# EAGLE design ESP32-S3 Parallel TFT with Touch 1.9“ ST7789V2 v1.1 (EAGLE 6.1)
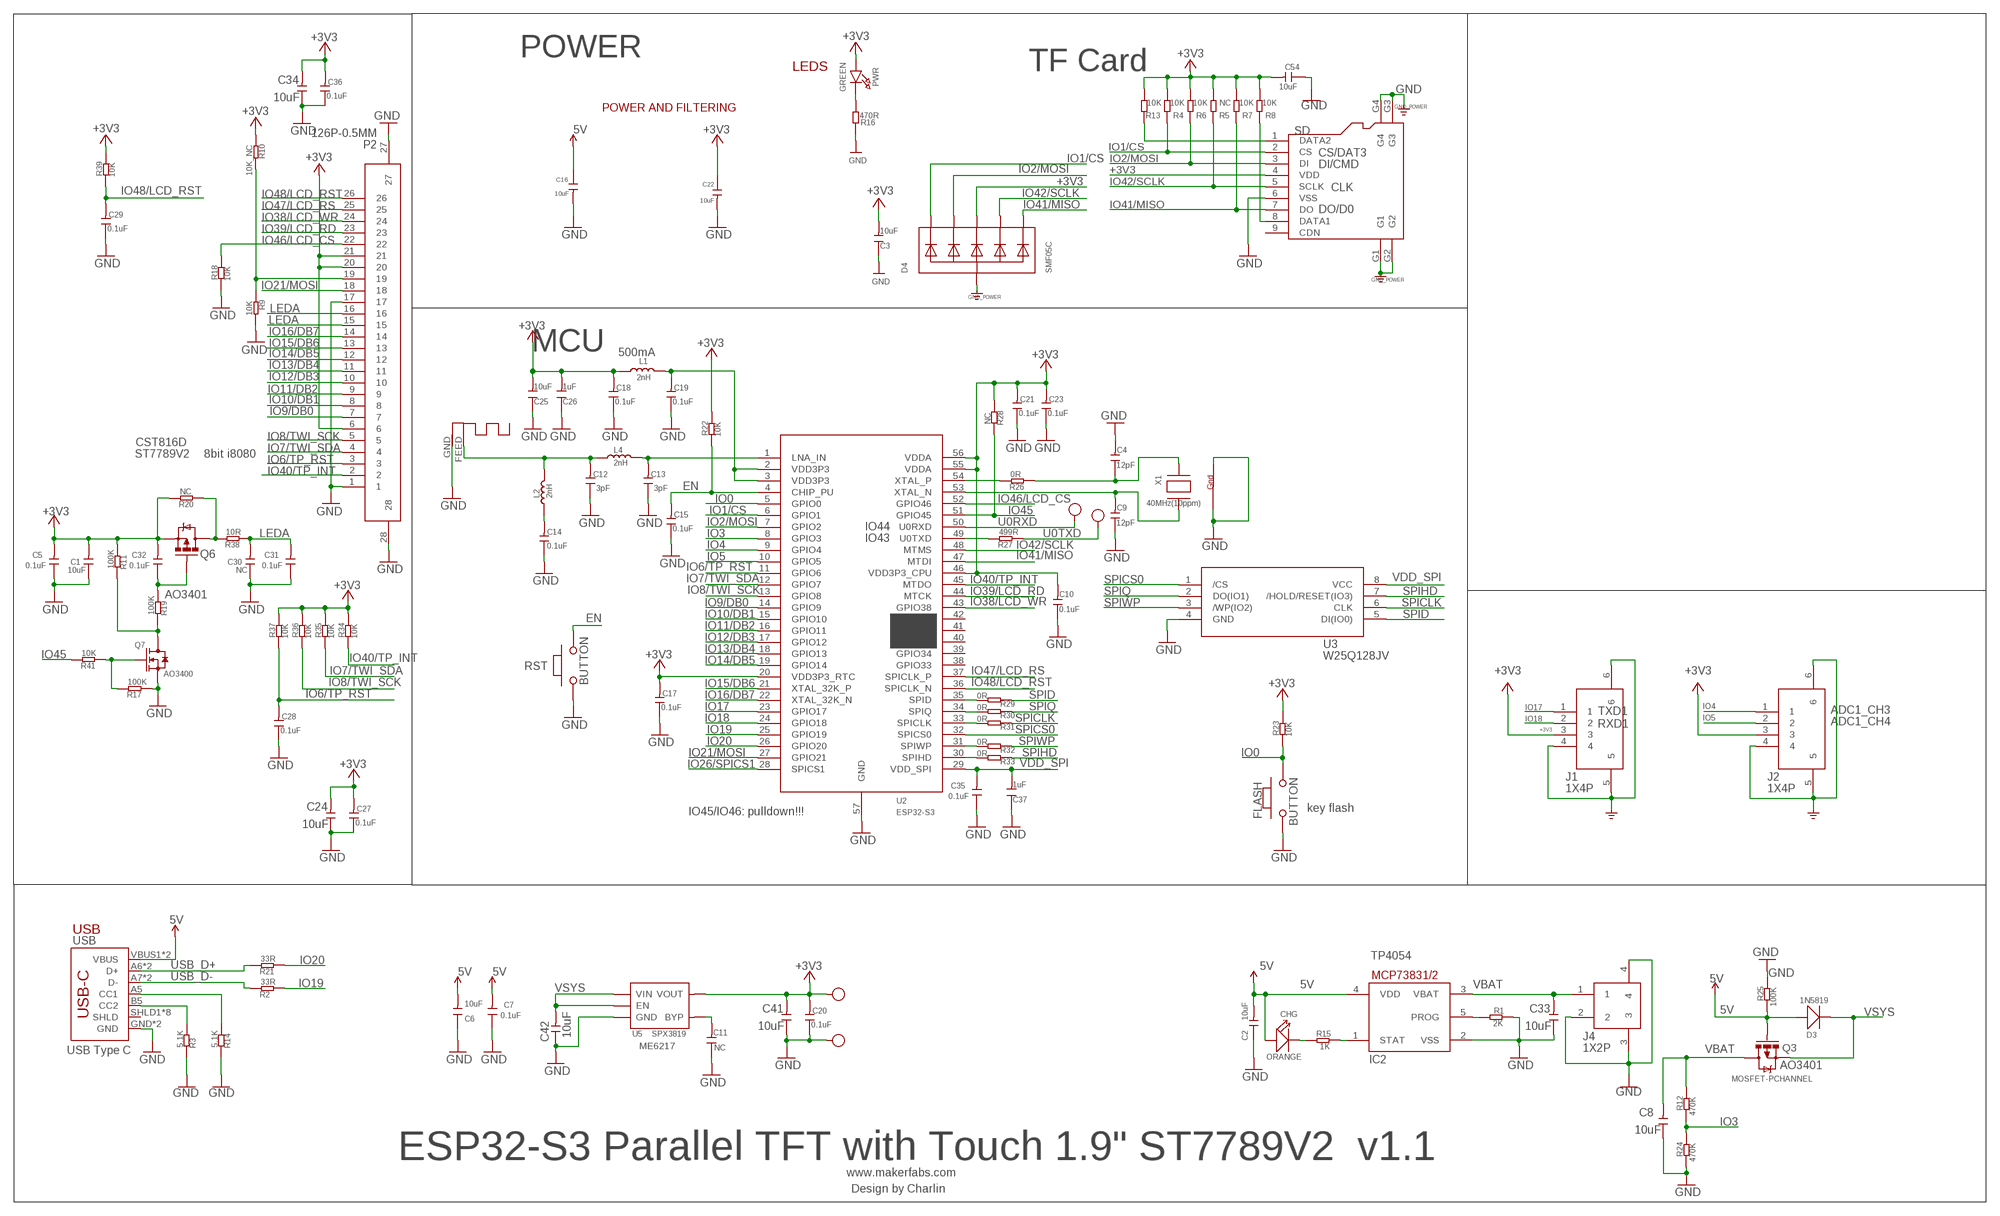
[diagram p0: schematic, sheet 1]

## Parts
ANT1  ANTENNA  [RN-ANT]
C1  10uF  C-0603  [0603]
C2  10uF  C-0603  [0603]
C3  10uF  DISCRETE_C-0603  [DISCRETE_C0603]
C4  12pF  DISCRETE_C-0402  [DISCRETE_C0402]
C5  0.1uF  DISCRETE_C-0402  [DISCRETE_C0402]
C6  10uF  DISCRETE_C-0603  [DISCRETE_C0603]
C7  0.1uF  DISCRETE_C-0402  [DISCRETE_C0402]
C8  10uF  C-0603  [0603]
C9  12pF  DISCRETE_C-0402  [DISCRETE_C0402]
C10  0.1uF  DISCRETE_C-0402  [DISCRETE_C0402]
C11  NC  DISCRETE_C-0402  [DISCRETE_C0402]
C12  3pF  DISCRETE_C-0402  [DISCRETE_C0402]
C13  3pF  DISCRETE_C-0402  [DISCRETE_C0402]
C14  0.1uF  DISCRETE_C-0402  [DISCRETE_C0402]
C15  0.1uF  DISCRETE_C-0402  [DISCRETE_C0402]
C16  10uF  C-0603  [0603]
C17  0.1uF  DISCRETE_C-0402  [DISCRETE_C0402]
C18  0.1uF  DISCRETE_C-0402  [DISCRETE_C0402]
C19  0.1uF  DISCRETE_C-0402  [DISCRETE_C0402]
C20  0.1uF  DISCRETE_C-0402  [DISCRETE_C0402]
C21  0.1uF  DISCRETE_C-0402  [DISCRETE_C0402]
C22  10uF  C-0603  [0603]
C23  0.1uF  DISCRETE_C-0402  [DISCRETE_C0402]
C24  10uF  C-0603  [0603]
C25  10uF  DISCRETE_C-0603  [DISCRETE_C0603]
C26  1uF  DISCRETE_C-0603  [DISCRETE_C0603]
C27  0.1uF  DISCRETE_C-0402  [DISCRETE_C0402]
C28  0.1uF  DISCRETE_C-0402  [DISCRETE_C0402]
C29  0.1uF  DISCRETE_C-0402  [DISCRETE_C0402]
C30  NC  C-0603  [0603]
C31  0.1uF  DISCRETE_C-0402  [DISCRETE_C0402]
C32  0.1uF  DISCRETE_C-0402  [DISCRETE_C0402]
C33  10uF  C-0603  [0603]
C34  10uF  C-0603  [0603]
C35  0.1uF  DISCRETE_C-0402  [DISCRETE_C0402]
C36  0.1uF  DISCRETE_C-0402  [DISCRETE_C0402]
C37  1uF  DISCRETE_C-0603  [DISCRETE_C0603]
C41  10uF  C-0603  [0603]
C42  10uF  C-0603  [0603]
C54  10uF  DISCRETE_C-0603  [DISCRETE_C0603]
CHG  ORANGE  007-LED0603  [D0603]
D3  1N5819  D'0805'  [SOD323]
D4  SMF05C  TVSARRAY_5LANE  [SOT363]
FLASH  BUTTON  PB157  [157SW]
G  TEST-POINT'4545'  [TP-D45MIL]
IC2  MCP73831/OT  [SOT23-5L]
J1  1X4P  [1X4P-SMT1.25MM]
J2  1X4P  [1X4P-SMT1.25MM]
J4  1X2P  [1X2P-SMT1.25MM]
L1  2nH  DISCRETE_L0603  [DISCRETE_L0603]
L2  2nH  DISCRETE_L0402  [DISCRETE_L0402]
L4  2nH  DISCRETE_L0402  [DISCRETE_L0402]
P2  126P-0.5MM  [1*26P-SMT0.5MM]
PWR  GREEN  LED0805_NOOUTLINE  [CHIPLED_0805_NOOUTLINE]
Q3  MOSFET-PCHANNEL  [SOT23-3]
Q6  MOSFET-PCHANNEL  [SOT23-3]
Q7  AO3400  DISCRETE_MOSFET-NSOT23  [DISCRETE_SOT23]
R1  2K  DISCRETE_R-0402  [DISCRETE_R0402]
R2  33R  DISCRETE_R-0402  [DISCRETE_R0402]
R3  5.1K  DISCRETE_R-0402  [DISCRETE_R0402]
R4  10K  DISCRETE_R-0402  [DISCRETE_R0402]
R5  NC  DISCRETE_R-0402  [DISCRETE_R0402]
R6  10K  DISCRETE_R-0402  [DISCRETE_R0402]
R7  10K  DISCRETE_R-0402  [DISCRETE_R0402]
R8  10K  DISCRETE_R-0402  [DISCRETE_R0402]
R9  10K  DISCRETE_R-0402  [DISCRETE_R0402]
R10  10K_NC  DISCRETE_R-0402  [DISCRETE_R0402]
R11  100K  DISCRETE_R-0402  [DISCRETE_R0402]
R12  470K  DISCRETE_R-0402  [DISCRETE_R0402]
R13  10K  DISCRETE_R-0402  [DISCRETE_R0402]
R14  5.1K  DISCRETE_R-0402  [DISCRETE_R0402]
R15  1K  DISCRETE_R-0402  [DISCRETE_R0402]
R16  470R  DISCRETE_R-0402  [DISCRETE_R0402]
R17  100K  DISCRETE_R-0402  [DISCRETE_R0402]
R18  10K  DISCRETE_R-0402  [DISCRETE_R0402]
R19  100K  DISCRETE_R-0402  [DISCRETE_R0402]
R20  NC  DISCRETE_R-0402  [DISCRETE_R0402]
R21  33R  DISCRETE_R-0402  [DISCRETE_R0402]
R22  10K  DISCRETE_R-0402  [DISCRETE_R0402]
R23  10K  DISCRETE_R-0402  [DISCRETE_R0402]
R24  470K  DISCRETE_R-0402  [DISCRETE_R0402]
R25  100K  DISCRETE_R-0402  [DISCRETE_R0402]
R26  0R  DISCRETE_R-0402  [DISCRETE_R0402]
R27  499R  DISCRETE_R-0402  [DISCRETE_R0402]
R28  NC  DISCRETE_R-0402  [DISCRETE_R0402]
R29  0R  DISCRETE_R-0402  [DISCRETE_R0402]
R30  0R  DISCRETE_R-0402  [DISCRETE_R0402]
R31  0R  DISCRETE_R-0402  [DISCRETE_R0402]
R32  0R  DISCRETE_R-0402  [DISCRETE_R0402]
R33  0R  DISCRETE_R-0402  [DISCRETE_R0402]
R34  10K  DISCRETE_R-0402  [DISCRETE_R0402]
R35  10K  DISCRETE_R-0402  [DISCRETE_R0402]
R36  10K  DISCRETE_R-0402  [DISCRETE_R0402]
R37  10K  DISCRETE_R-0402  [DISCRETE_R0402]
R38  10R  DISCRETE_R-0402  [DISCRETE_R0402]
R39  10K  DISCRETE_R-0402  [DISCRETE_R0402]
R41  10K  DISCRETE_R-0402  [DISCRETE_R0402]
RST  BUTTON  PB157  [157SW]
RX  TEST-POINT'4545'  [TP-D45MIL]
SD  HOLDER-MICROSD-9P  [9P-SMD-W/-RING]
TX  TEST-POINT'4545'  [TP-D45MIL]
U2  ESP32-S3  [QFN56-7*7MM]
U3  W25Q128JV  [SOIC-8-208MIL]
U5  SPX3819  [SOT23-5]
USB  USB_C5  [USB-C-16P-5]
V  TEST-POINT'4545'  [TP-D45MIL]
X1  40MHz(10ppm)  XTAL-4-3225  [NX3225]

## Nets
5V: C2.2 C6.2 C7.2 C16.1 CHG.+ D3.+ IC2.4(VDD) Q3.1(G) R25.1 USB.VBUS1(VBUS) USB.VBUS2(VBUS)
+3V3: C1.2 C3.2 C5.2 C10.2 C17.2 C18.2 C20.2 C21.2 C22.1 C23.2 C24.2 C25.2 C26.2 C27.2 C32.2 C34.2 C36.2 C41.2 C54.2 D4.4(C3) J1.3 J2.3 L1.1 P2.6 P2.20 P2.21 PWR.A Q6.2(S) R4.2 R5.2 R6.2 R7.2 R8.2 R10.2 R11.1 R13.2 R20.2 R22.2 R23.2 R28.1 R34.2 R35.2 R36.2 R37.2 R39.2 SD.4(VDD) U2.20(VDD3P3_RTC) U2.46(VDD3P3_CPU) U2.55(VDDA) U2.56(VDDA) U5.5(VOUT) V.T
EN: C15.2 R22.1 RST.2 U2.4(CHIP_PU)
GND: ANT1.GND C1.1 C2.1 C3.1 C4.2 C5.1 C6.1 C7.1 C8.1 C9.1 C10.1 C11.1 C12.1 C13.1 C14.1 C15.1 C16.2 C17.1 C18.1 C19.1 C20.1 C21.1 C22.2 C23.1 C24.1 C25.1 C26.1 C27.1 C28.1 C29.1 C30.1 C31.1 C33.1 C34.1 C35.1 C36.1 C37.1 C41.1 C42.1 C54.1 D4.2(A) FLASH.1 G.T IC2.2(VSS) J1.4 J1.5 J1.6 J2.4 J2.5 J2.6 J4.2 J4.3 J4.4 P2.1 P2.17 P2.27 P2.28 Q7.2(S) R1.2 R3.2 R9.1 R14.2 R16.1 R17.1 R18.1 R24.1 R25.2 RST.1 SD.6(VSS) SD.G1 SD.G2 SD.G3 SD.G4 U2.57(GND) U3.4(GND) U5.2(GND) USB.GND USB.GND2(GND) X1.2(G2) X1.4(G1) ; supply symbol labelled GND_POWER
IO0: FLASH.2 R23.1 U2.5(GPIO0)
IO1/CS: D4.1(C1) R4.1 SD.2(CS) U2.6(GPIO1)
IO2/MOSI: D4.3(C2) R6.1 SD.3(DI) U2.7(GPIO2)
IO3: R12.1 R24.2 U2.8(GPIO3)
IO4: J2.1 U2.9(GPIO4)
IO5: J2.2 U2.10(GPIO5)
IO6/TP_RST: C28.2 P2.3 R37.1 U2.11(GPIO6)
IO7/TWI_SDA: P2.4 R35.1 U2.12(GPIO7)
IO8/TWI_SCK: P2.5 R36.1 U2.13(GPIO8)
IO9/DB0: P2.7 U2.14(GPIO9)
IO10/DB1: P2.8 U2.15(GPIO10)
IO11/DB2: P2.9 U2.16(GPIO11)
IO12/DB3: P2.10 U2.17(GPIO12)
IO13/DB4: P2.11 U2.18(GPIO13)
IO14/DB5: P2.12 U2.19(GPIO14)
IO15/DB6: P2.13 U2.21(XTAL_32K_P)
IO16/DB7: P2.14 U2.22(XTAL_32K_N)
IO17: J1.1 U2.23(GPIO17)
IO18: J1.2 U2.24(GPIO18)
IO19: R2.1 U2.25(GPIO19)
IO20: R21.1 U2.26(GPIO20)
IO21/MOSI: P2.18 U2.27(GPIO21)
IO26/SPICS1: U2.28(SPICS1)
IO38/LCD_WR: P2.24 U2.43(GPIO38)
IO39/LCD_RD: P2.23 U2.44(MTCK)
IO40/TP_INT: P2.2 R34.1 U2.45(MTDO)
IO41/MISO: D4.6(C5) R7.1 SD.7(DO) U2.47(MTDI)
IO42/SCLK: D4.5(C4) R5.1 SD.5(SCLK) U2.48(MTMS)
IO45: R28.2 R41.2 U2.51(GPIO45)
IO46/LCD_CS: P2.22 R18.2 U2.52(GPIO46)
IO47/LCD_RS: P2.25 U2.37(SPICLK_P)
IO48/LCD_RST: C29.2 P2.26 R39.1 U2.36(SPICLK_N)
LEDA: C30.2 C31.2 P2.15 P2.16 R38.1
N$2: IC2.5(PROG) R1.1
N$3: C32.1 Q6.1(G) R19.1
N$6: R14.1 USB.A5(CC1)
N$7: PWR.C R16.2
N$8: P2.19 R9.2 R10.1
N$10: Q6.3(D) R20.1 R38.2
N$14: R3.1 USB.B5(CC2)
N$15: Q7.3(D) R11.2 R19.2
N$19: Q7.1(G) R17.2 R41.1
N$25: CHG.- R15.1
N$26: IC2.1(STAT) R15.2
N$30: ANT1.FEED C12.2 L2.2 L4.1
N$31: C13.2 L4.2 U2.1(LNA_IN)
N$32: R29.2 U2.35(SPID)
N$33: C19.2 L1.2 U2.2(VDD3P3) U2.3(VDD3P3)
N$34: C14.2 L2.1
N$35: R30.2 U2.34(SPIQ)
N$37: R26.2 U2.54(XTAL_P)
N$38: R31.2 U2.33(SPICLK)
N$40: R32.2 U2.31(SPIWP)
N$41: R33.2 U2.30(SPIHD)
N$47: R13.1 SD.1(DATA2)
N$48: R8.1 SD.8(DATA1)
N$63: R27.2 U2.49(U0TXD)
N$65: C9.2 U2.53(XTAL_N) X1.3(X2)
N$66: C4.1 R26.1 X1.1(X1)
N$76: C11.2 U5.4(BYP)
SPICLK: R31.1 U3.6(CLK)
SPICS0: U2.32(SPICS0) U3.1(/CS)
SPID: R29.1 U3.5(DI(IO0))
SPIHD: R33.1 U3.7(/HOLD/RESET(IO3))
SPIQ: R30.1 U3.2(DO(IO1))
SPIWP: R32.1 U3.3(/WP(IO2))
U0RXD: RX.T U2.50(U0RXD)
U0TXD: R27.1 TX.T
USB_D+: R21.2 USB.A6(D+) USB.B6(D+)
USB_D-: R2.2 USB.A7(D-) USB.B7(D-)
VBAT: C8.2 C33.2 IC2.3(VBAT) J4.1 Q3.3(D) R12.2
VDD_SPI: C35.2 C37.2 U2.29(VDD_SPI) U3.8(VCC)
VSYS: C42.2 D3.- Q3.2(S) U5.1(VIN) U5.3(EN)
Unconnected: SD.9(CDN) U2.38(GPIO33) U2.39(GPIO34) U2.40(GPIO35) U2.41(GPIO36) U2.42(GPIO37) USB.SHLD1(SHLD) USB.SHLD2(SHLD) USB.SHLD3(SHLD) USB.SHLD4(SHLD) USB.SHLD5(SHLD) USB.SHLD6(SHLD) USB.SHLD7(SHLD) USB.SHLD8(SHLD)

## Notes on the sheet
- POWER
- LEDS | TF Card
- POWER AND FILTERING
- CS/DAT3
- DI/CMD
- CLK
- DO/D0
- MCU
- 500mA
- CST816D
- ST7789V2 | 8bit i8080
- IO44
- IO43
- AO3401
- TXD1 | ADC1_CH3
- RXD1 | ADC1_CH4
- key flash
- IO45/IO46: pulldown!!!
- USB
- TP4054
- ME6217
- USB Type C
- AO3401
- ESP32-S3 Parallel TFT with Touch 1.9" ST7789V2  v1.1
- www.makerfabs.com
- Design by Charlin

## Library data of the parts
ANT1 = adafruit:ANTENNA
C1 C2 C8 C16 C22 C24 C30 C33 C34 C41 C42 = Discrete:C*: Ceramic Capacitors
C3-C7 C9-C15 C17-C21 C23 C25-C29 C31 C32 C35-C37 C54 = A9G:DISCRETE_C*: Ceramic Capacitors
CHG = Discrete:007-LED*
D3 = Discrete:D*
D4 = microbuilder:TVSARRAY_5LANE: Voltage Transient Suppressor Array SOT363 SMF05C - 100W 5V: Digikey - SMF05CT1GOSCT-ND
FLASH RST = MySMD:PB157
G RX TX V = Discrete-new:TEST-POINT; PARTNO: DNP
IC2 = adafruit:MCP73831: MCP73831/2 Miniature Single-Cell, Fully Integrated Li-Ion, Li-Polymer Charge Management Controllers. Nice and small simple lipoly charge controller, with adjustable current and status output (LED) http://www.ladyada.net/library/pcb/eaglelibrary.html
J1 J2 = sale:1X4P
J4 = sale:1X2P
L1 L2 L4 = A9G:DISCRETE_L*
P2 = sale:1*26P-0.5MM
PWR = microbuilder:LED: LED 0603 - 0603 Surface Mount Package 2mA: Green LED - Low Power (3.9mcd, 2ma, 1.7Vf) - Digikey: 475-2709-2-ND Orange LED - Low Power (9.8mcd, 2ma, 1.8Vf) - Digikey: 475-1194-2-ND Red LED - Low Power (5mcd, 2ma, 1.8Vf) - Digikey: 475-1195-2-ND Yellow LED - Low Power (7mcd, 2ma, 1.8Vf) - Digikey: 475-1196-2-ND 5mA: Blue LED - Low Power (17mcd, 5ma, 2.9Vf) - Digikey: LNJ937W8CRACT-ND 0805 - 0805 Surface Mount Package 2mA: Red LED (8.8mcd, 2mA, 1.8Vf, Clear) - Low Power [Digikey: 475-2510-1-ND] Green LED (5mcd, 2mA, 1.8Vf, Clear) - Low Power [Digikey: 475-2730-1-ND] Yellow LED (11.3mcd, 2mA, 1.8Vf, Clear) - Low Power [Digikey: 475-2555-1-ND] 20mA: Red LED (104mcd, 20mA, Diffused) - LS R976 [Digikey: 475-1278-6-ND] Red LED (12mcd, 20mA, 2.0Vf, Clear) - APT2012EC [Digikey: 754-1128-1-ND] Green LED (15mcd, 20mA, 2.2Vf, Clear) - APT2012GC [Digikey: 754-1131-1-ND] Orange LED (160mcd, 20mA, 2.1Vf, Clear) - APT2012SECK [Digikey: 754-1130-1-ND] 1206 - 1206 Surface Mount Package Green LED (26mcd, 20mA, Diffused) - LG N971 [Digikey: 475-1407-6-ND] Red LED (15mcd, 20mA, Diffused) - LH N974 [Digikey: 475-1416-6-ND] Cree - Cree High-Power Surface Mount LEDs XPEBWT-L1-0000-00D50 - White 111lm 350mA 2.9Vf 6200K 110° XTEAWT-00-0000-00000LEE3 - White 114lm 350mA 2.85Vf 5000K 115° Everlight - Everlight 45-21 Series Surface Mount LEDs 45-21/QK2C-B2832AC2CB2/2T - Warm White 2000mcd 20mA 3.25Vf 3050K 120° 45-21/LK2C-B38452C4CB2/2T - Nuetral White 2000mcd 20mA 3.25Vf 4150K 120° 45-21/LK2C-B50634C6CB2/2T - Cold White 2200mcd 20mA 3.25Vf 5650K 120° PLCC2 Reverse Mount LS T77K-J1L2-1-0-2-R18-Z - Red 11.25mcd 2mA 1.8Vf 630nm 120° LO T77K-L1M2-24-Z - Orange 19.6mcd 2mA 1.8Vf 606nm 120° LY T77K-K2M1-26-Z - Yellow 15.7mcd 2mA 1.8Vf 587nm 120°
Q3 Q6 = User-Submitted:MOSFET-PCHANNEL: Generic PMOSFET IRLML2244 - TRANS-11153 (SOT-23 -20V -4.3A) (1.Gate 2.Source 3.Drain) FQP27P06 - COM-10349 <http://www.sparkfun.com/products/10349> (TO-220 -60V -27A) (1.Gate 2.Source 3.Drain); PROD_ID: TRANS-08285
Q7 = A9G:DISCRETE_MOSFET-N: IRLL014: http://www.vishay.com/docs/91319/sihll014.pdf
R1-R39 R41 = A9G:DISCRETE_R*
SD = Connector:HOLDER-MICROSD-9P
U2 = sale:ESP32-S3
U3 = self:W25Q128JV
U5 = IC:SPX3819
USB = USBC:USB_C: USB Type C 16Pin Connector Super Speed pins not available on the 16-pin purely SMD connector so this part is best for USB 2.0 implementations. D1 and D2 are tied together enabling D+/- no matter which way the cable is plugged into the connector. The two channel configuration pins (CC1/2) are exposed. These are normally connected to ground via 5.1k resistors but can be reconfigured for high current/high power applications.
X1 = adafruit:XTAL-4: Classic 4-pin 3.2 x 2.5mm crystal

## Net classes
0 default: width 0.203 mm, drill 0.305 mm, clearance 0.152 mm
1 vbat: width 0.254 mm, drill 0.305 mm, clearance 0.152 mm

## Board
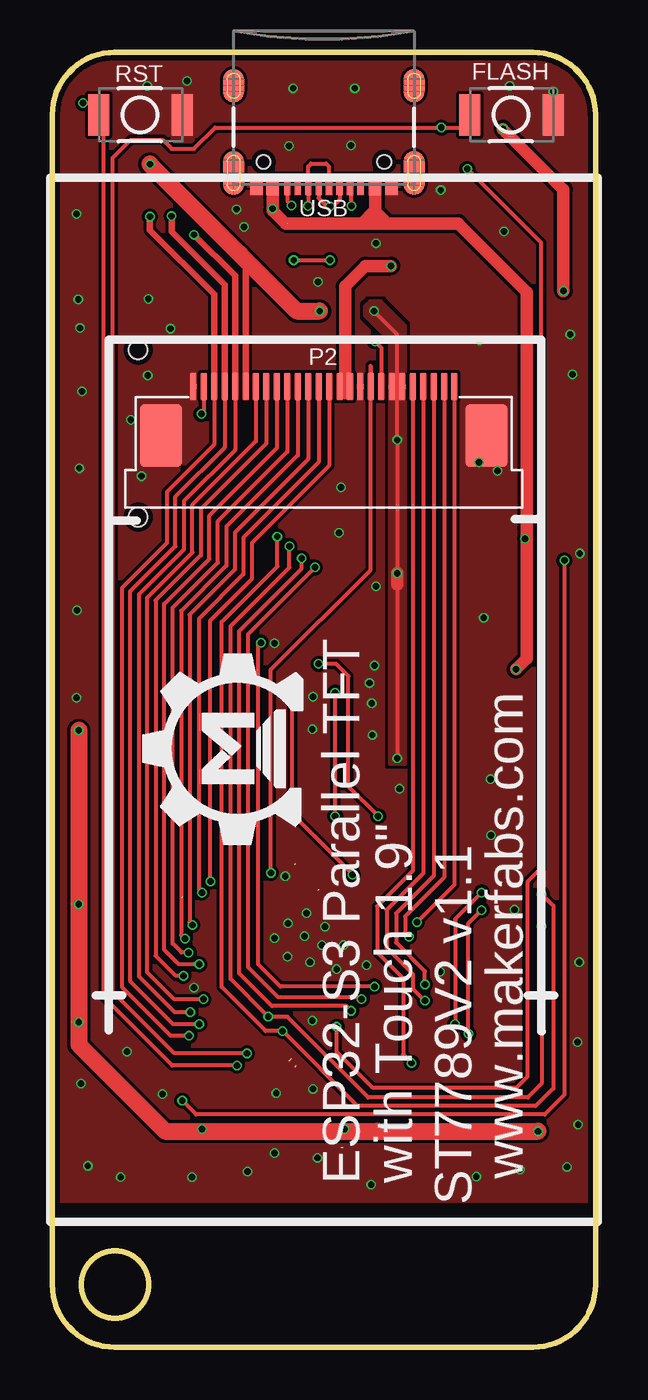
[diagram p1: board, top side]
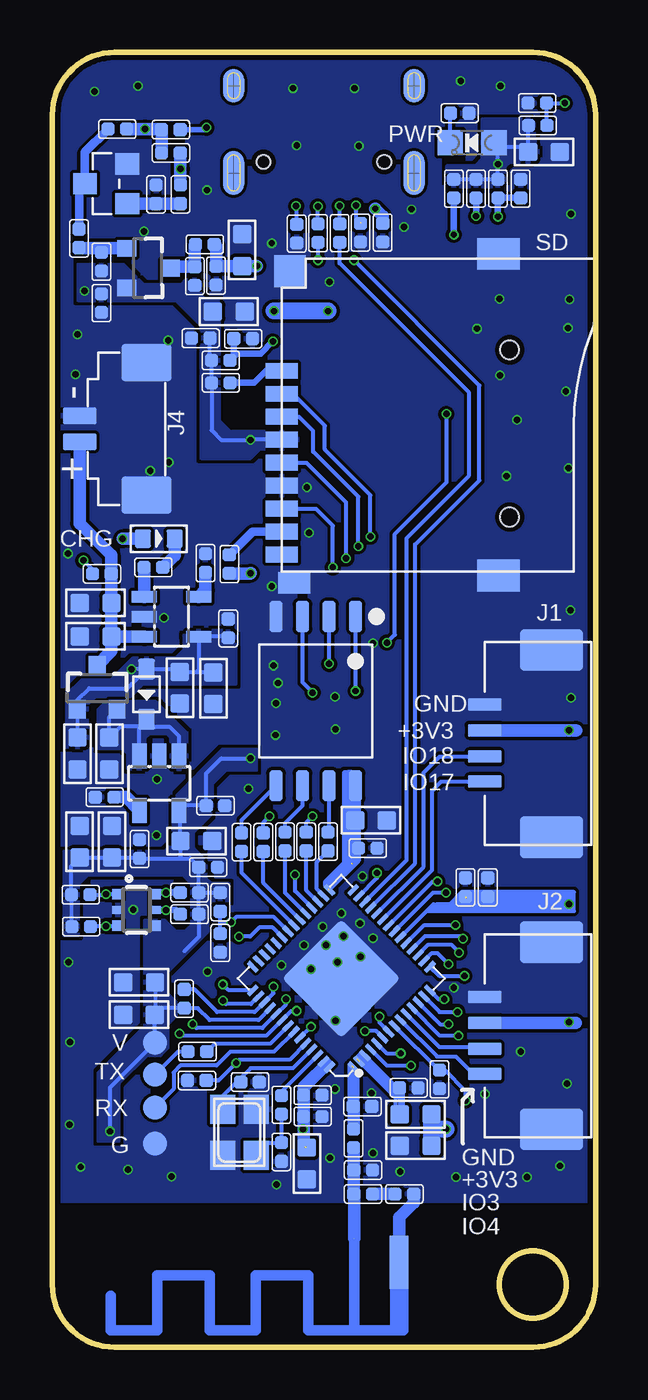
[diagram p2: board, bottom side, seen from below]

Size 26 x 62 mm. Coordinates in mm from the lower left corner, seen from the top.
Outline: 0,3 0,59 arc-90 3,62 23,62 arc-90 26,59 26,3 arc-90 23,0 3,0 arc-90 0,3
Outline: circle at 3,3 radius 1.6
Copper layers (1*16): Top 0.035mm / dielectric 1.5mm / Bottom 0.035mm
Design rules: minimum track width 6mil, minimum drill 10mil, track to track 6mil, track to pad 6mil, pad to pad 6mil, via to via 6mil, smd to smd 0mil, copper to edge 10mil, drill to drill 10mil, minimum pad ring 3mil, minimum via ring 3mil, stop-mask expansion 2mil, vias tented up to drill 100mil, thermal gap 0mil
tRestrict: area -0.1,-0.1 to 26,6.9
bRestrict: area -0.1,-0.1 to 26,6.9

### Footprints (pad centres in the part's own frame; a part is rotated, then mirrored left to right if it is on the bottom)
RN-ANT = smd 0.025 x 0.025: FEED 0,2.159 | smd 2.54 x 0.889: GND -1.143,0
0603 = smd 0.889 x 0.889: 1 -0.762,0; 2 0.762,0
DISCRETE_C0603 = smd 0.889 x 0.889: 1 -0.762,0; 2 0.762,0
DISCRETE_C0402 = smd 0.635 x 0.635: 1 -0.445,0; 2 0.445,0
D0603 = smd 0.762 x 0.889: + -0.762,0; - 0.762,0
SOD323 = smd 1 x 0.8: + -1.2,0; - 1.2,0
SOT363 = smd 0.5 x 0.5: 1 -0.75,-0.9; 3 0.75,-0.9; 4 0.75,0.9; 6 -0.75,0.9 | smd 0.4 x 0.5: 2 0,-0.9; 5 0,0.9
157SW = smd 1.016 x 1.981: 1 0,0; 2 4,0
TP-D45MIL = smd 1.143 x 1.143: T 0,0
SOT23-5L = smd 0.55 x 1.2: 1 -0.95,-1.3; 2 0,-1.3; 3 0.95,-1.3; 4 0.95,1.3; 5 -0.95,1.3
1X4P-SMT1.25MM = smd 0.6 x 1.6: 1 -1.825,2.54; 2 -0.625,2.54; 3 0.625,2.54; 4 1.875,2.54 | smd 2 x 3: 5 4.475,-0.66; 6 -4.475,-0.66
1X2P-SMT1.25MM = smd 0.8 x 1.6: 1 -0.625,0; 2 0.625,0 | smd 1.8 x 2.4: 3 3.175,-3.2; 4 -3.175,-3.2
DISCRETE_L0603 = smd 0.889 x 0.889: 1 -0.762,0; 2 0.762,0
DISCRETE_L0402 = smd 0.635 x 0.635: 1 -0.445,0; 2 0.445,0
1*26P-SMT0.5MM = smd 0.3 x 1.3: 1 -6.25,0; 2 -5.75,0; 3 -5.25,0; 4 -4.75,0; 5 -4.25,0; 6 -3.75,0; 7 -3.25,0; 8 -2.75,0; 9 -2.25,0; 10 -1.75,0; 11 -1.25,0; 12 -0.75,0; 13 -0.25,0; 14 0.25,0; 15 0.75,0; 16 1.25,0; 17 1.75,0; 18 2.25,0; 19 2.75,0; 20 3.25,0; 21 3.75,0; 22 4.25,0; 23 4.75,0; 24 5.25,0; 25 5.75,0; 26 6.25,0 | smd 2 x 3: 27 7.79,-2.35; 28 -7.79,-2.35
CHIPLED_0805_NOOUTLINE = smd 1.2 x 1.2: A 0,-1.05; C 0,1.05
SOT23-3 = smd 0.8 x 0.9: 1 -0.95,-1; 2 0.95,-1; 3 0,1.1
DISCRETE_SOT23 = smd 1.016 x 1.143: 1 -0.95,-1.016; 2 0.95,-1.016; 3 0,1.016
DISCRETE_R0402 = smd 0.635 x 0.635: 1 -0.445,0; 2 0.445,0
9P-SMD-W/-RING = smd 1.524 x 0.762: 1 0,4.4; 2 0,3.3; 3 0,2.2; 4 0,1.1; 5 0,0; 6 0,-1.1; 7 0,-2.2; 8 0,-3.3; 9 0,-4.4 | smd 1.524 x 1.016: G1 0.6,-5.746 | smd 2.032 x 1.524: G2 10.373,-5.4; G3 10.373,10 | smd 1.524 x 1.524: G4 0.392,9.181 | hole 0.889: 10.9,-2.6; 10.9,5.4
QFN56-7*7MM = smd 0.6 x 0.2: 1 -3.4,2.6; 2 -3.4,2.2; 3 -3.4,1.8; 4 -3.4,1.4; 5 -3.4,1; 6 -3.4,0.6; 7 -3.4,0.2; 8 -3.4,-0.2; 9 -3.4,-0.6; 10 -3.4,-1; 11 -3.4,-1.4; 12 -3.4,-1.8; 13 -3.4,-2.2; 14 -3.4,-2.6; 29 3.4,-2.6; 30 3.4,-2.2; 31 3.4,-1.8; 32 3.4,-1.4; 33 3.4,-1; 34 3.4,-0.6; 35 3.4,-0.2; 36 3.4,0.2; 37 3.4,0.6; 38 3.4,1; 39 3.4,1.4; 40 3.4,1.8; 41 3.4,2.2; 42 3.4,2.6 | smd 0.2 x 0.6: 15 -2.6,-3.4; 16 -2.2,-3.4; 17 -1.8,-3.4; 18 -1.4,-3.4; 19 -1,-3.4; 20 -0.6,-3.4; 21 -0.2,-3.4; 22 0.2,-3.4; 23 0.6,-3.4; 24 1,-3.4; 25 1.4,-3.4; 26 1.8,-3.4; 27 2.2,-3.4; 28 2.6,-3.4; 43 2.6,3.4; 44 2.2,3.4; 45 1.8,3.4; 46 1.4,3.4; 47 1,3.4; 48 0.6,3.4; 49 0.2,3.4; 50 -0.2,3.4; 51 -0.6,3.4; 52 -1,3.4; 53 -1.4,3.4; 54 -1.8,3.4; 55 -2.2,3.4; 56 -2.6,3.4 | smd 4 x 4: 57 0,0
SOIC-8-208MIL = smd 1.5 x 0.635: 1 -4.05,1.905; 2 -4.05,0.635; 3 -4.05,-0.635; 4 -4.05,-1.905; 5 4.05,-1.905; 6 4.05,-0.635; 7 4.05,0.635; 8 4.05,1.905
SOT23-5 = smd 0.69 x 1.2: 1 -0.95,-1.3; 2 0,-1.3; 3 0.95,-1.3; 4 0.95,1.3; 5 -0.95,1.3
USB-C-16P-5 = smd 0.3 x 1: A5 -1.25,-0.34; A6 -0.25,-0.34; A7 0.25,-0.34; A8 1.25,-0.34; B5 1.75,-0.34; B6 0.75,-0.34; B7 -0.75,-0.34; B8 -1.75,-0.34 | smd 0.6 x 1: GND -3.225,-0.34; GND2 3.225,-0.34; VBUS1 -2.45,-0.34; VBUS2 2.45,-0.34 | smd 1 x 2.1: SHLD1 -4.32,-0.915; SHLD2 4.32,-0.915 | smd 1 x 2.1 bottom: SHLD3 -4.32,-0.915; SHLD4 4.32,-0.915 | smd 1 x 1.6: SHLD5 -4.32,-5.095; SHLD8 4.32,-5.095 | smd 1 x 1.6 bottom: SHLD6 -4.32,-5.095; SHLD7 4.32,-5.095 | hole 0.65: -2.89,-1.445; 2.89,-1.445
NX3225 = smd 1.4 x 1.2: 1 -1.1,-0.8; 2 1.1,-0.8; 3 1.1,0.8; 4 -1.1,0.8

### Placement (x,y rotation side)
ANT1  9.4,5.21 90 bottom
C1  19.1,24.23 180 bottom
C2  24.79,28.42 90 bottom
C3  21.84,17.48 0 bottom
C4  15.04,9.35 270 bottom
C5  23.65,49.99 90 bottom
C6  19.89,31.57 90 bottom
C7  10.19,53.37 90 bottom
C8  23.93,34.04 0 bottom
C9  16.54,12.7 180 bottom
C10  5.16,22.02 270 bottom
C11  23.5,26.34 0 bottom
C12  11.13,8.48 180 bottom
C13  11.15,11.53 180 bottom
C14  9.14,7.34 180 bottom
C15  2.79,59.56 0 bottom
C16  18.29,31.55 270 bottom
C17  13.54,11.05 180 bottom
C18  13.54,12.06 180 bottom
C19  8.94,12.42 180 bottom
C20  6.22,22.02 270 bottom
C21  18.54,22.99 180 bottom
C22  13.81,8.8 270 bottom
C23  21.82,23.85 270 bottom
C24  8.61,9.65 0 bottom
C25  2.46,57.23 180 bottom
C26  24.69,24.21 270 bottom
C27  18.19,25.93 180 bottom
C28  3.58,55.47 270 bottom
C29  17.96,19.35 90 bottom
C30  16.92,52.53 270 bottom
C31  18.16,51.31 90 bottom
C32  23.65,51.97 270 bottom
C33  23.93,35.64 0 bottom
C34  23.14,24.21 270 bottom
C35  10.9,23.9 180 bottom
C36  18.9,48.31 0 bottom
C37  10.74,25.22 180 bottom
C41  17.55,49.58 180 bottom
C42  23.27,28.42 90 bottom
C54  21.85,15.92 0 bottom
CHG  20.9,38.71 0 bottom
D3  21.49,31.27 270 bottom
D4  21.97,20.93 270 bottom
FLASH  23.98,59 180 top
G  21.08,9.75 0 bottom
IC2  20.29,34.98 270 bottom
J1  2.77,28.91 90 bottom
J2  2.77,14.91 90 bottom
J4  24.69,43.97 90 bottom
L1  8.61,11.15 180 bottom
L2  11.13,7.34 180 bottom
L4  11.58,10.01 90 bottom
P2  13,46 0 top
PWR  5.91,57.66 90 bottom
Q3  23.85,31.55 0 bottom
Q6  21.44,51.66 270 bottom
Q7  23.42,55.7 90 bottom
R1  18.67,37.54 90 bottom
R2  13.28,53.34 90 bottom
R3  11.25,53.37 270 bottom
R4  24.64,21.67 180 bottom
R5  19.43,20.73 0 bottom
R6  24.61,20.14 180 bottom
R7  19.43,21.77 0 bottom
R8  17.53,37.49 270 bottom
R9  16.87,48.29 180 bottom
R10  17.93,47.24 180 bottom
R11  22.89,58.32 180 bottom
R12  23.62,37.03 0 bottom
R13  17.93,46.18 180 bottom
R14  14.3,53.31 270 bottom
R15  21.16,37.34 180 bottom
R16  6.5,59.08 180 bottom
R17  21.03,55.19 270 bottom
R18  19.08,12.78 0 bottom
R19  24.71,53.09 90 bottom
R20  19.18,51.28 270 bottom
R21  12.24,53.34 90 bottom
R22  2.77,58.5 180 bottom
R23  20.32,58.29 180 bottom
R24  7.47,12.83 90 bottom
R25  17.58,34.42 90 bottom
R26  15.04,11.61 90 bottom
R27  19.05,14.15 0 bottom
R28  20.32,57.18 0 bottom
R29  16.94,24.18 270 bottom
R30  15.9,24.18 270 bottom
R31  14.86,24.21 270 bottom
R32  13.84,24.21 270 bottom
R33  12.8,24.21 270 bottom
R34  19.68,16.69 270 bottom
R35  5.71,55.47 90 bottom
R36  6.78,55.47 90 bottom
R37  4.67,55.47 90 bottom
R38  18.69,52.81 180 bottom
R39  17.96,21.31 90 bottom
R41  19.86,55.19 90 bottom
RST  6.23,59 180 top
RX  21.08,11.48 0 bottom
SD  15.01,42.35 0 bottom
TX  21.08,13.06 0 bottom
U2  12.17,17.65 135 bottom
U3  13.39,30.94 270 bottom
U5  20.88,27 180 bottom
U$1  [MAKERFABS_0.3]  11.93,24.54 90 top
USB  13,55.3 180 top
V  21.08,14.58 0 bottom
X1  17.04,10.29 90 bottom

### Tracks (layer width: path | path; a pad name or v marks a point on that pad's centre or on a via)
5V  (via drill 0.3)
  Top 0.203: v22.63,38.71 22.71,38.79 22.71,39.22 | v10.54,54.51 v10.55,54.52 10.55,55.07
  Top 0.61: 14.83,53.8 11.18,53.8 10.55,54.42 10.55,55.07 USB.VBUS2 | 14.83,53.8 15.27,53.8 | 15.27,53.8 16.05,53.8 | 16.05,53.8 19.43,53.8 22.71,50.52 22.71,39.22 22.71,32.97 v22.2,32.46 | USB.VBUS1 15.45,53.98 15.27,53.8 | 14.83,53.8 15.44,54.41 16.05,53.8
  Bottom 0.203: C2.2 24.8,29.2 Q3.1 24.8,30.98 24.23,31.55 22.41,31.55 D3.+ | D3.+ 20.02,32.47 C6.2 19.1,32.33 | 19.1,32.33 18.31,32.33 C16.1 | 19.1,32.33 19,32.44 IC2.4 17.63,34.03 R25.1 | D3.+ v22.2,32.46
  Bottom 0.61: CHG.+ v22.63,38.71 | C7.2 10.19,54.15 v10.54,54.51
  pour Bottom: 17.22,34.29 19.48,34.29 19.68,34.09 19.68,33.38 20.09,32.97 22.15,32.97 22.45,32.66 23.19,31.93 24.59,31.93 25.3,31.22 25.3,28.73 24.33,28.73 24.33,30.78 23.93,31.19 22.25,31.19 21.67,31.78 17.35,31.78 17.22,31.78
+3V3  (via drill 0.3)  (2 unrouted)
  Top 0.203: P2.20 P2.21 | v15.39,49.61 16.51,48.49 v16.51,43.43 v16.51,37.06 | 16.51,36.52 v16.51,28.19 | v13.99,10.44 14.1,10.34 15.57,10.34 | 5.41,10.34 7.06,10.34 v7.16,10.44
  Top 0.305: P2.6 9.25,52.07 8.98,52.34
  Top 0.61: v16.51,37.06 16.51,36.52 | v24.46,50.57 24.46,55.42 v21.57,58.32
  Top 0.813: v4.67,56.64 8.98,52.34 11.71,49.61 v12.8,49.61 | v23.24,10.34 15.57,10.34 5.41,10.34 1.27,14.48 v1.27,15.57 v1.27,21.21 v1.27,29.54
  Bottom 0.203: U2.56 U2.55 | U2.55 13.98,12.73 C18.2 C17.2 13.98,10.45 v13.99,10.44 13.98,10.58 | 0.92,29.53 v1.27,29.54 | 7.82,11.18 L1.1 | 0.95,15.54 v1.27,15.57 | U2.20 7.76,21.21 7.59,21.21 | 6.99,21.21 6.25,21.21 | 6.25,21.21 5.26,21.21 | 5.26,21.21 v1.27,21.21 | C36.2 18.45,47.32 R10.2 R13.2 18.38,43.9 17.91,43.43 v16.51,43.43 16.5,43.45 SD.4 | R36.2 R35.2 R37.2 4.67,57.48 | 4.67,57.48 PWR.A | R22.2 3.23,58.48 C25.2 3.48,57.48 4.67,57.48 | C20.2 6.25,21.55 6.25,21.21 | C10.2 5.26,21.48 5.26,21.21 | 13.99,9.75 C22.1 | R6.2 25.06,21.64 R4.2 25.08,23.05 C26.2 C34.2 21.86,23.44 C23.2 19.91,23.41 | 21.08,20.17 D4.4 | R39.2 18.97,21.75 R7.2 | R7.2 R5.2 18.99,19.65 19.66,18.97 | R7.2 C21.2 19.41,23.41 19.91,23.41 | 19.91,23.41 19.86,23.46 C1.2 19.86,25.63 U5.5 19.7,25.93 C27.2 18.63,27.47 17.91,28.19 v16.51,28.19 | 20.82,16.18 C54.2 | C3.2 C54.2 | C54.2 20.76,16.24 R34.2 19.02,16.23 18.47,15.67 16.13,15.67 U2.46 | 12.6,13.54 13.77,12.37 13.77,9.78 14.15,9.78 14.15,12.55 | 14.15,12.55 12.93,13.77 12.8,13.77 12.68,13.64 12.78,13.64 12.93,13.49 | U2.55 14.15,12.56 14.15,12.55 | V.T 23.24,12.43 v23.24,10.34 | V.T | V.T C54.2 | 8.08,20.88 1.04,20.88 1.04,21.79 6.4,21.79 6.99,21.21 | 6.99,21.21 7.59,21.21 | 7.59,21.21 7.77,21.03 1.19,21.03 1.19,21.61 5.89,21.61 5.89,21.41 6.07,21.41
  Bottom 0.305: 12.93,13.49 13.92,12.5 13.92,9.58 | 6.07,21.41 1.25,21.41 | 6.2,21.51 6.43,21.51 6.78,21.16
  Bottom 0.61: J1.3 0.92,29.53 | J2.3 0.95,15.54 | R8.2 16.52,37.05 v16.51,37.06 | R28.1 R23.2 20.79,58.32 v21.57,58.32 R11.1
  Bottom 0.813: C24.2 7.85,10.62 | 7.85,10.62 L1.1 | v12.8,49.61 v15.39,49.61 | v7.16,10.44 7.67,10.44 7.85,10.62
  pour Bottom: 7.11,55.58 4.52,55.58 4.34,55.75 4.34,56.54 4.11,56.77 2.77,56.77 2.77,57.66 2.92,57.81 2.92,58.78 5.41,58.78 5.41,56.87 5.74,56.54 7.09,56.54 7.11,56.54
  pour Bottom: 14.25,43.81 17.48,43.81 18.01,44.35 18.01,50.09 18.87,50.09 18.87,42.57 16.54,42.57 16.08,43.03 14.25,43.03
  pour Bottom: 24.77,19.74 24.77,22.17 24.31,22.63 19.76,22.63 19.33,22.2 19.33,20.19 19.63,19.89 20.09,19.89 20.62,20.42 21.56,20.42 21.56,15.34 23.8,13.11 23.8,9.91 22.81,9.91 22.81,12.65 21.46,14 20.83,14 20.47,14.35 20.47,15.49 19.91,16.05 19.91,16.33 20.52,16.94 20.52,17.96 18.57,19.91 18.57,21.18 18.34,21.41 17.55,21.41 17.55,22.17 18.39,22.17 18.64,22.43 18.64,23.27 19.25,23.88 19.25,24.66 18.34,25.58 18.34,27 17.68,27.66 16.23,27.66 16.23,28.6 17.86,28.6 20.22,26.24 20.22,24.13 20.62,23.72 25.43,23.72 25.43,19.74
  pour Top: 16.89,27.94 16.89,48.9 15.72,50.06 15.21,50.06 14.96,49.81 14.96,49.4 16.15,48.21 16.15,27.97 16.15,27.94
  pour Bottom: 24.77,50.14 20.07,50.14 18.8,48.87 18.29,48.87 18.29,50.09 18.64,50.09 18.9,50.34 18.9,51.1 19.58,51.1 19.84,50.85 21.62,50.85 22.58,51.82 24.66,51.82 24.77,51.82
EN  (via drill 0.3)
  Top 0.203: v8.84,13.49 5.74,13.49 2.46,16.76 2.46,59.45 C15.2 2.34,59.55 2.34,59.46 RST.2 2.22,59.56 v1.47,59.56
  Bottom 0.203: R22.1 2.32,59.54 | 2.32,59.54 C15.2 | 2.32,59.54 2.3,59.56 v1.47,59.56 | U2.4 9.98,13.49 v8.84,13.49
GND  (via drill 0.3)
  Bottom 0.61: ANT1.GND 9.4,6.22 8.7,6.92 C14.1
  other vias: 3.28,8.15 13.72,38.99 13.82,41.17 21.31,41.96 20.65,34.92 25.25,38 20.98,27.2 15.32,29.31 16.61,26.75 11.25,18.69 12.06,19.68 13.61,18.11 12.34,18.44 12.9,19.25 18.57,17.98 12.45,15.65 22.12,20.95 21.01,24.51 20.42,42.37 12.73,51 15.49,52.86 9.17,53.64 8.81,54.48 18.59,55.4 21.62,53.42 14.3,57.53 11.33,57.51 14.48,60.27 11.53,60.27 6.45,60.63 4.55,60.38 21.89,60.38 23.98,60.12 4.6,50.19 5.66,48.77 1.17,54.25 1.24,50.16 1.32,48.79 1.42,45.77 1.3,42.09 1.19,35.28 3.76,44.4 4.27,41.71 4.57,46.53 1.17,31.09 1.7,8.69 6.68,8.15 9.35,8.41 10.72,12.17 12.47,12.37 24.64,8.64 22.38,8.51 20.29,8.18 25.22,18.44 25.15,14.61 25.17,10.67 12.45,29.59 15.42,32.64 15.29,30.84 11.15,22.56 15.49,36.42 10.64,9.3 3.58,14.15 1.37,12.62 5.28,12.12 6.78,17.22 10.64,19.58 11.28,20.29 12.17,20.78 13.06,20.14 13.94,19.25 15.04,18.29 15.19,31.8 10.64,33.71 12.47,31.14 20.45,48.21 24.79,48.49 24.89,46.58 15.27,7.8 12.7,9.07
  pour Top (rank 6): -3,85 -3,-5 30,-5 30,85
  pour Bottom (rank 6): -5,-5 30,-5 30,85 -5,85
IO0  (via drill 0.3)
  Top 0.203: FLASH.2 19.56,58.4 v18.62,58.4 7.8,58.4 6.78,57.38 5.71,57.38 5.28,57.81 3.76,57.81 2.9,56.95 2.9,17.02 5.84,14.07 v9.32,14.07
  Bottom 0.203: U2.5 10,14.07 v9.32,14.07
  Bottom 0.254: R23.1 18.72,58.29 v18.62,58.4
IO1/CS  (via drill 0.3)
  Top 0.203: v23.42,21.69 23.98,21.13 23.98,12.39 23.14,11.56 14.61,11.56 v11.02,15.14 10.21,15.14 8.1,17.25 8.1,34.72 10.77,37.39 v10.77,38.81
  Bottom 0.203: D4.1 v23.41,21.68 v23.42,21.69 23.44,21.67 R4.1 | SD.2 14.48,45.65 12.95,44.12 12.95,42.98 10.77,40.79 v10.77,38.81 | U2.6 10.5,15.14 v11.02,15.14
IO2/MOSI  (via drill 0.3)
  Top 0.203: v23.42,20.17 23.42,12.62 22.76,11.96 15.11,11.96 11.25,15.82 v10.34,15.82 8.53,17.63 8.53,34.52 11.35,37.34 v11.35,38.35
  Bottom 0.203: U2.7 10.34,15.54 v10.34,15.82 | R6.1 24.14,20.17 v23.42,20.17 22.89,20.17 D4.3 | SD.3 14.19,44.55 13.51,43.87 13.51,42.88 11.35,40.72 v11.35,38.35
IO3  (via drill 0.3)
  Top 0.203: v6.22,11.81 6.88,11.15 23.57,11.15 24.51,12.09 v24.51,37.67
  Bottom 0.203: U2.8 7.5,13.27 R24.2 7.23,13.27 6.22,12.27 v6.22,11.81 | R12.1 24.07,37.22 v24.51,37.67
IO4
  Bottom 0.203: J2.1 5.84,13.08 6.68,13.92 7.58,13.92 U2.9
IO5
  Bottom 0.203: U2.10 7.48,14.38 5.4,14.38 J2.2
IO6/TP_RST  (via drill 0.3)
  Top 0.203: P2.3 7.75,43.21 5.49,40.95 5.49,38.51 3.33,36.35 3.33,17.25 5.66,14.91 v6.55,14.91
  Top 0.305: P2.3 7.75,50.42 4.67,53.49 v4.67,54.13
  Bottom 0.203: v6.55,14.91 7.44,14.91 U2.11
  Bottom 0.305: v4.67,54.13 R37.1 C28.2
IO7/TWI_SDA  (via drill 0.3)
  Top 0.203: P2.4 8.25,43.07 5.89,40.72 5.89,38.35 3.73,36.2 3.73,17.53 5.79,15.47 v7.04,15.47
  Top 0.305: P2.4 8.25,50.88 5.71,53.42 v5.71,54.15
  Bottom 0.203: U2.12 7.44,15.47 v7.04,15.47
  Bottom 0.305: R35.1 v5.71,54.15
IO8/TWI_SCK  (via drill 0.3)
  Top 0.203: P2.5 8.75,42.96 6.3,40.51 6.3,38.2 4.14,36.04 4.14,17.75 5.84,16.05 v6.6,16.05
  Top 0.305: P2.5 8.75,51.3 v6.78,53.26
  Bottom 0.203: U2.13 7.46,16.05 v6.6,16.05
  Bottom 0.305: R36.1 v6.78,53.26
IO9/DB0  (via drill 0.3)
  Top 0.203: P2.7 9.75,43.38 6.71,40.34 6.71,38.05 4.55,35.89 4.55,17.96 5.84,16.66 v7.24,16.66
  Bottom 0.203: U2.14 7.5,16.66 v7.24,16.66
IO10/DB1  (via drill 0.3)
  Top 0.203: P2.8 10.25,43.27 7.11,40.13 7.11,37.92 4.95,35.76 4.95,18.75 5.92,17.78 v6.27,17.78
  Bottom 0.203: U2.15 7.49,17.78 v6.27,17.78
IO11/DB2  (via drill 0.3)
  Top 0.203: P2.9 10.75,43.06 7.52,39.83 7.52,37.74 5.36,35.59 5.36,19.02 6.04,18.34 v7.04,18.34
  Bottom 0.203: U2.16 7.84,18.87 7.57,18.87 v7.04,18.34
IO12/DB3  (via drill 0.3)
  Top 0.203: P2.10 11.25,42.87 7.92,39.55 7.92,37.57 5.77,35.41 5.77,19.33 6.2,18.9 v6.53,18.9
  Bottom 0.203: U2.17 8,19.28 6.91,19.28 v6.53,18.9
IO13/DB4  (via drill 0.3)
  Top 0.203: P2.11 11.75,42.71 8.33,39.29 8.33,37.41 6.17,35.26 6.17,19.74 v6.35,19.56
  Bottom 0.203: U2.18 8.15,19.68 6.48,19.68 v6.35,19.56
IO14/DB5  (via drill 0.3)
  Top 0.203: P2.12 12.25,42.53 8.74,39.01 8.74,37.24 6.58,35.08 6.58,20.34 v6.71,20.22
  Bottom 0.203: U2.19 8.19,20.22 v6.71,20.22
IO15/DB6  (via drill 0.3)
  Top 0.203: P2.13 12.75,42.37 9.14,38.76 9.14,37.01 7.04,34.9 7.04,21.89 v7.16,21.77
  Bottom 0.203: U2.21 7.77,21.77 v7.16,21.77
IO16/DB7  (via drill 0.3)
  Top 0.203: P2.14 13.25,42.21 9.55,38.51 9.55,36.78 7.57,34.8 v7.57,22.3
  Bottom 0.203: U2.22 7.8,22.3 v7.57,22.3
IO17
  Bottom 0.203: U2.23 7.82,22.84 7.82,26.64 7.39,27.08 J1.1
IO18
  Bottom 0.203: U2.24 8.23,23 8.23,27.51 7.46,28.28 J1.2
IO19  (via drill 0.3)
  Top 0.203: v11.56,52.05 v13.28,52.05
  Bottom 0.203: U2.25 8.64,23.16 8.64,38.43 5.56,41.5 5.56,46.05 v11.56,52.05 | R2.1 v13.28,52.05
IO20
  Bottom 0.203: U2.26 9.04,23.32 9.04,38.73 6.04,41.73 6.04,45.7 12.24,51.89 R21.1
IO21/MOSI  (via drill 0.3)
  Top 0.203: P2.18 15.24,46.99 15.24,37.21 10.46,32.44 v10.46,22.71
  Bottom 0.203: U2.27 10.46,22.47 v10.46,22.71
IO38/LCD_WR  (via drill 0.3)
  Top 0.203: P2.24 18.25,22.57 16.46,20.78 16.46,19.38 17.84,18 v17.84,17.37
  Bottom 0.203: U2.43 17.55,17.09 v17.84,17.37
IO39/LCD_RD  (via drill 0.3)
  Top 0.203: P2.23 17.75,22.68 16,20.93 16,19.13 17.27,17.86 17.27,17.14 v17.83,16.59
  Bottom 0.203: U2.44 16.5,16.43 17.68,16.43 v17.83,16.59
IO40/TP_INT  (via drill 0.3)
  Top 0.203: v15.42,17.27 10.92,17.27 9.86,18.34 9.86,33.6 v9.98,33.73 | P2.2 7.25,44.79 v7.14,44.68
  Bottom 0.203: v15.42,17.27 15.42,16.95 U2.45 16.31,16.05 18.11,16.05 19.19,17.13 R34.1 | v9.98,33.73 9.6,34.11 9.6,38.94 7.14,41.4 v7.14,44.68
IO41/MISO  (via drill 0.3)
  Top 0.203: v19.28,15.47 19.28,20.5 v20.55,21.77 | v12.57,37.34 9.37,34.14 9.37,18.19 10.79,16.76 14.71,16.76 v14.81,16.66
  Bottom 0.203: 21.04,21.72 D4.6 | v19.28,15.47 19.1,15.29 15.94,15.29 U2.47 14.81,16.43 v14.81,16.66 | SD.7 13.39,40.15 12.57,39.33 v12.57,37.34
  Bottom 0.305: R7.1 v20.55,21.77 20.98,21.77 D4.6
IO42/SCLK  (via drill 0.3)
  Top 0.203: v19.91,15.01 19.91,20.3 v20.55,20.93 | v14.3,16.1 14.07,16.33 10.52,16.33 8.94,17.91 8.94,34.29 11.94,37.29 v11.94,37.77
  Bottom 0.203: v19.91,15.01 19.81,14.91 15.76,14.91 U2.48 14.56,16.1 v14.3,16.1 | SD.5 13.84,42.35 11.94,40.44 v11.94,37.77
  Bottom 0.305: D4.5 v20.55,20.93 20.08,20.93 R5.1
IO45  (via drill 0.3)
  Top 0.203: v13.61,15.34 13.61,14.15 15.34,12.42 22.2,12.42 22.73,12.95 22.73,22.28 23.39,22.94 23.39,52.88 v19.86,56.41
  Bottom 0.203: U2.51 13.63,15.34 v13.61,15.34
  Bottom 0.61: R41.2 v19.86,56.41 19.86,57.16 R28.2
IO46/LCD_CS  (via drill 0.3)
  Top 0.203: P2.22 17.25,22.81 15.54,21.11 15.54,18.9 16.79,17.65 16.79,14.02 v17.2,13.61
  Bottom 0.203: 13.86,14.56 U2.52 14.64,13.77 17.04,13.77 v17.2,13.61 18.03,12.78 R18.2 18.09,12.78
IO47/LCD_RS  (via drill 0.3)
  Top 0.203: P2.25 18.75,22.48 16.89,20.62 16.89,19.84 v17.07,19.66
  Bottom 0.203: U2.37 15.45,20.09 16.1,20.09 16.54,19.66 v17.07,19.66
IO48/LCD_RST  (via drill 0.3)
  Top 0.203: P2.26 19.25,22.15 v17.45,20.34
  Bottom 0.203: U2.36 15.4,20.6 17.2,20.6 v17.45,20.34 17.96,20.34 | C29.2 17.96,20.34 | 17.96,20.34 R39.1
LEDA  (via drill 0.3)
  Top 0.203: P2.15 P2.16 14.19,47 14.02,47.17
  Top 0.61: 14.02,45.67 14.02,47.17 14.02,50.8 14.99,51.77 v16.2,51.77
  Bottom 0.61: v16.2,51.77 C30.2 16.93,51.75 C31.2 18.16,52.72 R38.1
N$2
  Bottom 0.61: IC2.5 18.67,36.25 R1.1
N$3
  Bottom 0.61: Q6.1 23.72,52.61 | 23.72,52.61 24.69,52.61 R19.1 | C32.1 23.65,52.54 23.72,52.61
N$6  (via drill 0.3)
  Top 0.203: USB.A5 14.28,55.62 14.28,54.69 v14.33,54.63
  Bottom 0.203: R14.1 14.3,54.61 v14.33,54.63
N$7
  Bottom 0.203: PWR.C R16.2
N$8  (via drill 0.3)
  Top 0.203: v15.44,48.16 15.75,47.85 P2.19
  Bottom 0.305: R9.2 17.31,47.42 R10.1 17.16,47.57 16.03,47.57 v15.44,48.16
N$10
  Bottom 0.61: R38.2 19.18,52.77 R20.1 20.27,51.73 Q6.3
N$14  (via drill 0.3)  (1 unrouted)
  Top 0.203: USB.B5 11.25,54.87 v11.46,54.66
  Bottom 0.203: 11.23,53.85 11.46,54.08 v11.46,54.66
N$15
  Bottom 0.406: R19.2 24.71,55.42 Q7.3 24.43,57.21 R11.2
N$19
  Bottom 0.61: Q7.1 R17.2 R41.1
N$25
  Bottom 0.61: CHG.- 20.14,37.91 R15.1
N$26
  Bottom 0.61: IC2.1 R15.2
N$30
  Bottom 0.61: ANT1.FEED 11.56,7.33 L2.2 C12.2 L4.1
N$31  (1 unrouted)
  Bottom 0.203: U2.1 C13.2 | 11.79,13.49 11.79,11.58 11.38,11.58 11.38,13.18 11.48,13.28 | 11.66,13.46 11.48,13.28 | 11.48,13.28 11.48,11.68
  Bottom 0.61: L4.2 11.58,11.52 C13.2
N$32
  Bottom 0.203: U2.35 16.94,22.71 R29.2
N$33  (1 unrouted)
  Bottom 0.203: U2.2 U2.3 | U2.3 | U2.3 9.48,12.42 C19.2 9.37,12.41 L1.2 | 11.43,13.82 9.58,11.96 9.58,10.95 9.2,10.95 9.2,12.22 9.32,12.22 9.5,12.04
  Bottom 0.305: 9.5,12.04 9.5,12.17 11.28,13.95
N$34
  Bottom 0.61: C14.2 L2.1
N$35
  Bottom 0.203: U2.34 15.9,22.23 R30.2
N$37
  Bottom 0.203: U2.54 15.04,12.24 R26.2
N$38
  Bottom 0.203: U2.33 14.86,21.76 R31.2
N$40
  Bottom 0.203: U2.31 13.84,21.88 R32.2
N$41
  Bottom 0.203: U2.30 13.34,21.93 13.34,23.23 R33.2
N$47
  Bottom 0.305: SD.1 15.76,46.75 16.33,46.18 R13.1
N$48
  Bottom 0.406: SD.8 16.41,39.05 R8.1
N$63
  Bottom 0.203: U2.49 15.57,14.53 18.22,14.53 R27.2
N$65
  Bottom 0.203: U2.53 14.48,13.36 16.51,13.36 17.03,12.84 | 17.03,12.84 17.84,12.03 X1.3 | C9.2 17.03,12.75 17.03,12.84
N$66
  Bottom 0.203: R26.1 C4.1 15.64,9.79 X1.1
N$76
  Bottom 0.61: C11.2 22.47,26.34 U5.4
SPICLK
  Bottom 0.203: R31.1 14.86,25.09 14.02,25.93 U3.6
SPICS0  (via drill 0.3)
  Top 0.203: v14.38,22.63 11.48,25.53 v11.48,31.42
  Bottom 0.203: U2.32 14.38,21.84 v14.38,22.63 | v11.48,31.42 U3.1
SPID
  Bottom 0.203: R29.1 16.94,25.24 U3.5
SPIHD
  Bottom 0.203: R33.1 12.75,24.7 U3.7
SPIQ  (via drill 0.3)
  Top 0.203: v15.6,25.43 14.17,26.85 14.17,32.13 13.59,32.72 v12.75,32.72
  Bottom 0.203: R30.1 15.9,25.12 v15.6,25.43 | v12.75,32.72 U3.2
SPIWP  (via drill 0.3)
  Top 0.203: v13.54,25.43 v13.54,31.34
  Bottom 0.203: R32.1 13.84,25.12 v13.54,25.43 | v13.54,31.34 14.02,31.83 U3.3
U0RXD
  Bottom 0.203: U2.50 15.39,14.15 17.48,14.15 18.14,13.49 19.86,13.49 20.19,13.16 20.19,12.37 RX.T
U0TXD
  Bottom 0.203: R27.1 19.99,14.15 TX.T
USB_D+  (via drill 0.3)
  Top 0.203: USB.A6 13.23,55.66 13.23,56.54 13.11,56.67 12.39,56.67 12.25,56.52 USB.B6 v12.24,54.63
  Bottom 0.203: R21.2 v12.24,54.63
USB_D-  (via drill 0.3)
  Top 0.203: USB.B7 13.75,54.95 13.41,54.61 v13.28,54.61 13.16,54.61 12.75,55.02 USB.A7
  Bottom 0.203: R2.2 v13.28,54.61
VBAT
  Bottom 0.61: J4.1 24.69,39.45 23.18,37.94 R12.2 23.16,37.02 C33.2 C8.2 | IC2.3 23.16,34.03 C8.2 | C8.2 23.16,33.33 Q3.3
VDD_SPI  (2 unrouted)
  Bottom 0.203: U2.29 11.34,23.29 C35.2 | C37.2 11.48,25.25 | 11.48,25.25 11.48,25.48 U3.8 11.48,27.13 | 12.78,21.95 12.83,22 11.66,23.16 11.66,27.53 | 11.66,27.53 11.86,27.53 | 11.86,27.53 11.86,23.16 12.93,22.1 12.93,22.3 12.01,23.22 12.01,27.53 11.86,27.53 | 11.66,27.53 11.38,27.53 11.38,27 | 11.61,23.11 11.48,23.24 11.48,25.25
  Bottom 0.305: 11.38,27 11.38,24.05
VSYS
  Bottom 0.203: Q3.2 23.27,30.18 C42.2 22.72,29.73 21.83,29.73 | U5.3 21.83,29.73 | 21.83,29.73 D3.- 21.11,29.69 20.37,29.69 19.93,29.25 U5.1
  pour Bottom: 19.56,27.69 19.56,29.39 20.73,30.56 21.06,30.89 23.29,30.89 23.42,30.89 23.8,30.51 23.8,28.7 22.63,28.7 22.38,28.45 22.38,27.71 21.56,27.71 21.56,29.18 21.34,29.41 20.52,29.41 20.32,29.21 20.32,27.69

### Text on the board
tPlace: ESP32-S3 Parallel TFT | with Touch 1.9" | www.makerfabs.com | ST7789V2 v1.1
bPlace: - | + | GND | +3V3 | IO18 | IO17 | GND | +3V3 | IO3 | IO4